# EAGLE schematic muses72320_D (EAGLE 7.2.0)
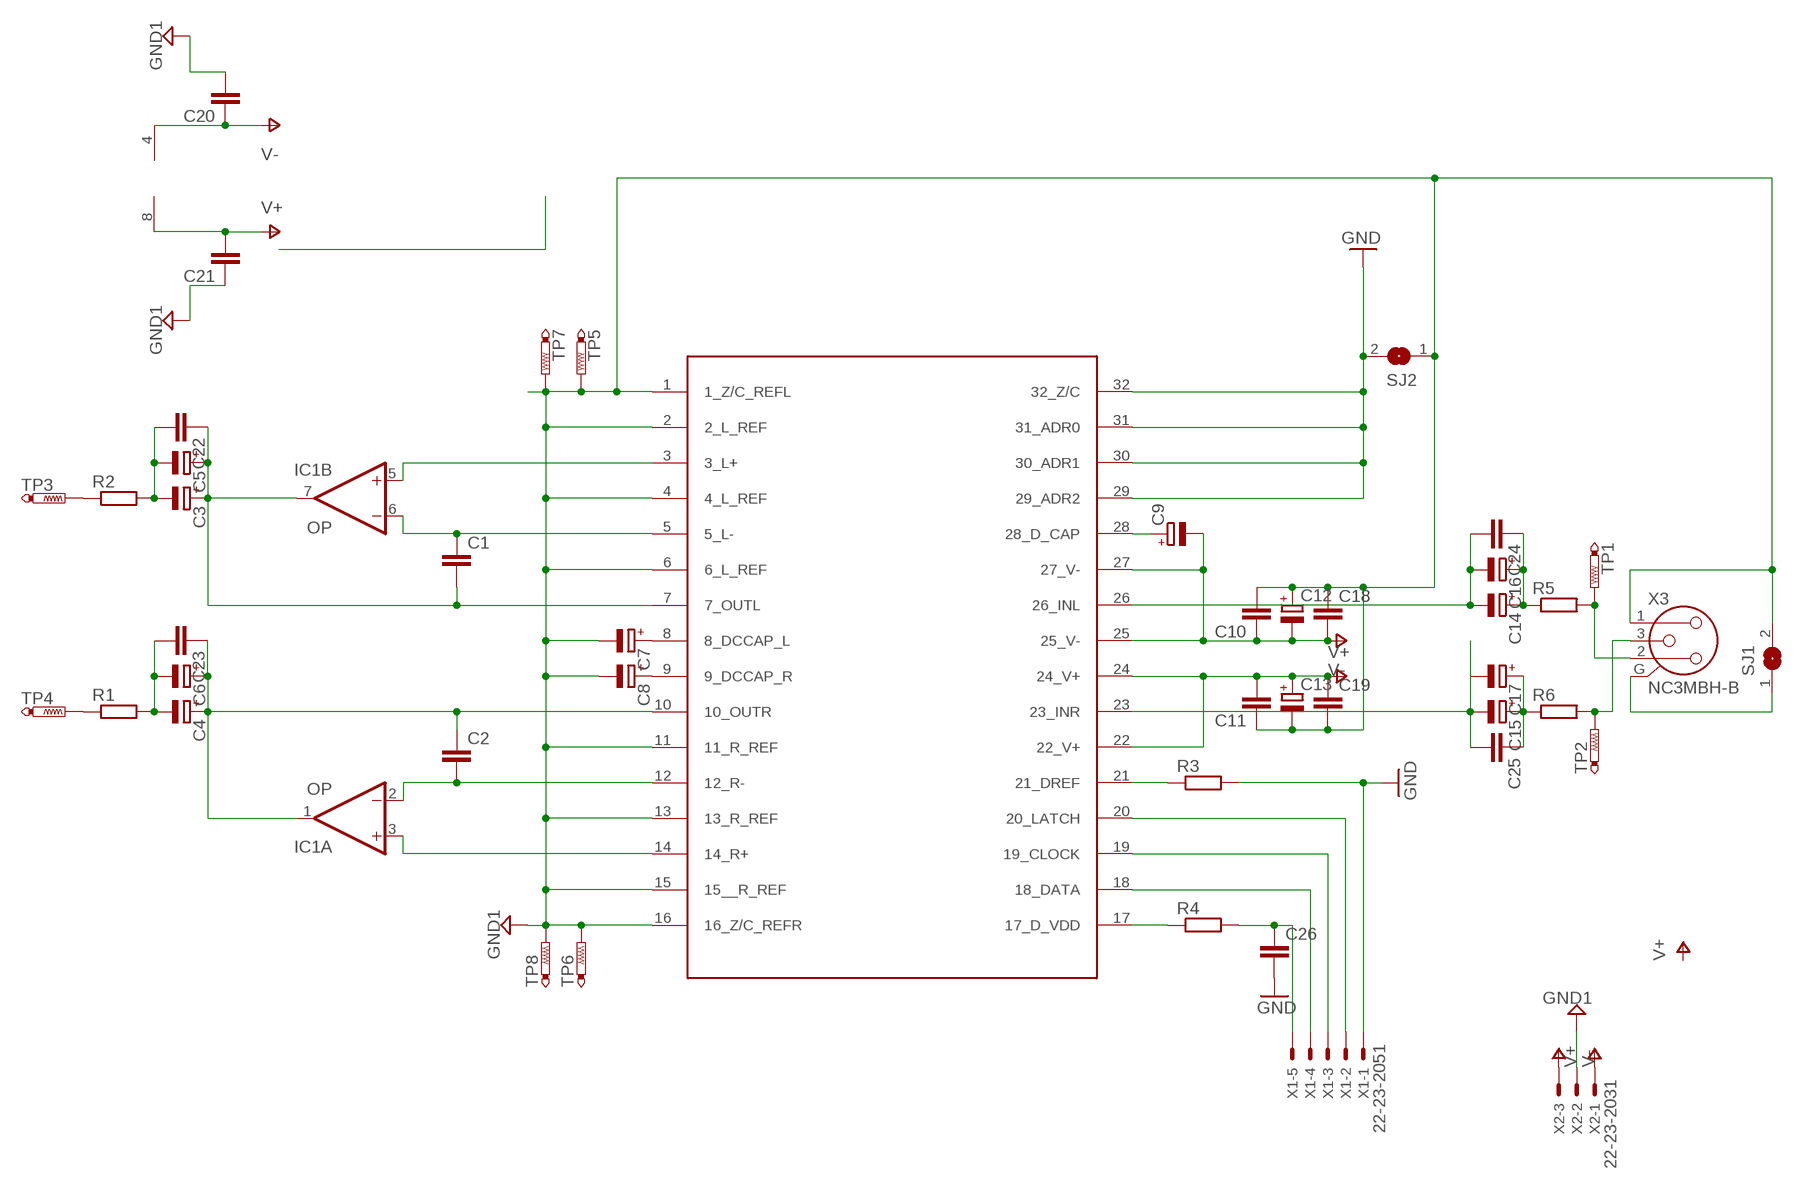
[diagram p0: schematic, sheet 1]

## Parts
C1  C-EU075-032X103  [C075-032X103]
C2  C-EU075-032X103  [C075-032X103]
C3  CPOL-EUE5-10.5  [E5-10,5]
C4  CPOL-EUE5-10.5  [E5-10,5]
C5  CPOL-EUE3.5-8  [E3,5-8]
C6  CPOL-EUE3.5-8  [E3,5-8]
C7  CPOL-EUE5-8.5  [E5-8,5]
C8  CPOL-EUE5-8.5  [E5-8,5]
C9  CPOL-EUE3.5-8  [E3,5-8]
C10  C-EU050-050X075  [C050-050X075]
C11  C-EU050-050X075  [C050-050X075]
C12  CPOL-EUE5-10.5  [E5-10,5]
C13  CPOL-EUE5-10.5  [E5-10,5]
C14  CPOL-EUE3.5-8  [E3,5-8]
C15  CPOL-EUE3.5-8  [E3,5-8]
C16  CPOL-EUE5-10.5  [E5-10,5]
C17  CPOL-EUE5-10.5  [E5-10,5]
C18  C-EUC1206  [C1206]
C19  C-EUC1206  [C1206]
C20  C-EU050-050X075  [C050-050X075]
C21  C-EU050-050X075  [C050-050X075]
C22  C-EU050-050X075  [C050-050X075]
C23  C-EU050-050X075  [C050-050X075]
C24  C-EU050-050X075  [C050-050X075]
C25  C-EU050-050X075  [C050-050X075]
C26  C-EUC1206  [C1206]
IC1  OP  LM4558N  [DIL08]
R1  R-EU_0207/7  [0207/7]
R2  R-EU_0207/7  [0207/7]
R3  R-EU_R1206  [R1206]
R4  R-EU_R1206  [R1206]
R5  R-EU_0207/7  [0207/7]
R6  R-EU_0207/7  [0207/7]
SJ1  SJ  [SJ]
SJ2  SJ  [SJ]
TP1  PTR1PAD1-20  [P1-20]
TP2  PTR1PAD1-20  [P1-20]
TP3  PTR1PAD1-20  [P1-20]
TP4  PTR1PAD1-20  [P1-20]
TP5  PTR1PAD1-20  [P1-20]
TP6  PTR1PAD1-20  [P1-20]
TP7  PTR1PAD1-20  [P1-20]
TP8  PTR1PAD1-20  [P1-20]
U$1  MUSES72320  [SSOP28DB]
X1  22-23-2051  [22-23-2051]
X2  22-23-2031  [22-23-2031]
X3  NC3MBH-B  [NC3MBH-B]

## Nets
CLOCK: U$1.19(19_CLOCK) X1.3
DATA: U$1.18(18_DATA) X1.4
GND: C26.2 R3.2 SJ2.2 U$1.29(29_ADR2) U$1.30(30_ADR1) U$1.31(31_ADR0) U$1.32(32_Z/C) X1.1
GND1: C7.- C8.- C10.2 C11.1 C12.+ C13.- C18.1 C19.2 C20.2 C21.1 SJ1.2 SJ2.1 TP5.TP TP6.TP TP7.TP TP8.TP U$1.1(1_Z/C_REFL) U$1.2(2_L_REF) U$1.4(4_L_REF) U$1.6(6_L_REF) U$1.11(11_R_REF) U$1.13(13_R_REF) U$1.15(15__R_REF) U$1.16(16_Z/C_REFR) X2.2 X3.1
LATCH: U$1.20(20_LATCH) X1.2
N$2: IC1.3(A:+IN) U$1.14(14_R+)
N$3: C2.2 IC1.2(A:-IN) U$1.12(12_R-)
N$4: C1.1 IC1.6(B:-IN) U$1.5(5_L-)
N$5: IC1.5(B:+IN) U$1.3(3_L+)
N$6: C1.2 C3.+ C5.+ C22.1 IC1.7(B:OUT) U$1.7(7_OUTL)
N$7: C2.1 C4.+ C6.+ C23.1 IC1.1(A:OUT) U$1.10(10_OUTR)
N$8: C3.- C5.- C22.2 R2.2
N$9: C4.- C6.- C23.2 R1.2
N$10: C7.+ U$1.8(8_DCCAP_L)
N$11: C8.+ U$1.9(9_DCCAP_R)
N$12: SJ1.1 X3.G
N$13: R5.2 TP1.TP X3.2
N$14: R6.2 TP2.TP X3.3
N$15: R3.1 U$1.21(21_DREF)
N$16: R4.1 U$1.17(17_D_VDD)
N$17: C9.+ U$1.28(28_D_CAP)
N$19: R2.1 TP3.TP
N$20: R1.1 TP4.TP
N$21: C26.1 R4.2 X1.5
N$23: C15.- C17.- C25.2 U$1.23(23_INR)
N$24: C14.- C16.- C24.2 U$1.26(26_INL)
N$25: C14.+ C16.+ C24.1 R5.1
N$26: C15.+ C17.+ C25.1 R6.1
V+: C11.2 C13.+ C19.1 C21.2 IC1.8(P:V+) U$1.22(22_V+) U$1.24(24_V+) X2.1
V-: C9.- C10.1 C12.- C18.2 C20.1 IC1.4(P:V-) U$1.25(25_V-) U$1.27(27_V-) X2.3

## Library data of the parts
C1 C2 C10 C11 C18-C26 = Vwvwbg:C-EU: CAPACITOR, European symbol
C3-C9 C12-C17 = Vwvwbg:CPOL-EU: POLARIZED CAPACITOR, European symbol
IC1 = linear:*4558: OP AMP
R1-R6 = Vwvwbg:R-EU_: RESISTOR, European symbol
SJ1 SJ2 = jumper:SJ: SMD solder JUMPER
TP1-TP8 = testpad:PTR1: TEST PIN
U$1 = Vwvwbg:MUSES72320
X1 = con-molex:22-23-2051: .100" (2.54mm) Center Header - 5 Pin; MF: MOLEX; MPN: 22-23-2051; OC_FARNELL: 1462952; OC_NEWARK: 38C9178
X2 = con-molex:22-23-2031: .100" (2.54mm) Center Header - 3 Pin; MF: MOLEX; MPN: 22-23-2031; OC_FARNELL: 1462950; OC_NEWARK: 30C0862
X3 = con-neutrik_ag:NC3: Neutrik Audio Connector XLR SERIES Stereo 1/4" jack Source: www.neutrik.com/; MPN: NC3MBH-B; OC_FARNELL: unknown; OC_NEWARK: 27B4288